# Altium schematic sheet MAIN.SchDoc
size 420 x 297 mm; SheetNumber: 1; SheetTotal: 1
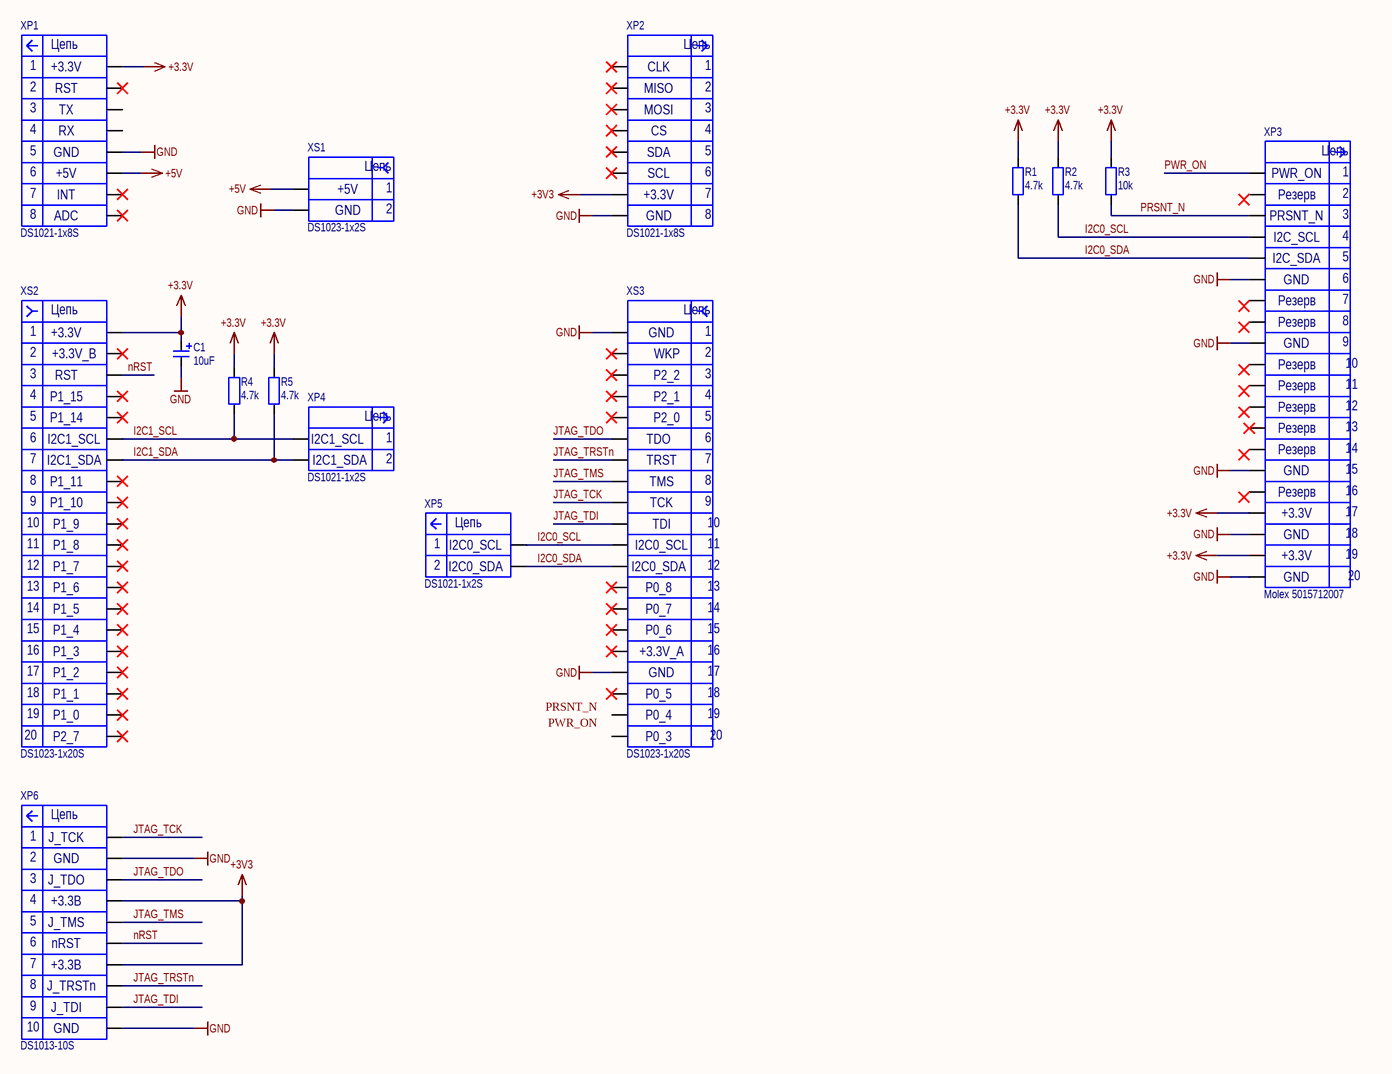
[diagram p0: MAIN.SchDoc]

## Parts
C1  10uF  [CAP ALSMD ELEC 4.3MM H5.4MM]
R1  4.7k  [RES 0603_1608]
R2  4.7k  [RES 0603_1608]
R3  10k  [RES 0603_1608]
R4  4.7k  [RES 0603_1608]
R5  4.7k  [RES 0603_1608]
XP1  DS1021-1x8S  Net_8: ADC  Net_7: INT  Net_6: +5V  Net_5: GND  Net_4: RX  Net_3: TX  Net_2: RST  Net_1: +3.3V  [DS1021-1x8S]
XP2  DS1021-1x8S  Net_8: GND  Net_7: +3.3V  Net_6: SCL  Net_5: SDA  Net_4: CS  Net_3: MOSI  Net_2: MISO  Net_1: CLK  [DS1021-1x8S]
XP3  Molex 5015712007  Net_20: GND  Net_19: +3.3V  Net_16: Резерв  Net_5: I2C_SDA  Net_4: I2C_SCL  Net_3: PRSNT_N  Net_1: PWR_ON  [Molex 5015712007]
XP4  DS1021-1x2S  Net_2: I2C1_SDA  Net_1: I2C1_SCL  [DS1021-1x2S]
XP5  DS1021-1x2S  Net_2: I2C0_SDA  Net_1: I2C0_SCL  [DS1021-1x2S]
XP6  DS1013-10S  Net_10: GND  Net_9: J_TDI  Net_8: J_TRSTn  Net_7: +3.3В  Net_6: nRST  Net_5: J_TMS  Net_3: J_TDO  Net_1: J_TCK  [DS1013-10S]
XS1  DS1023-1x2S  Net_2: GND  Net_1: +5V  [DS1023-1x2S]
XS2  DS1023-1x20S  Net_20: P2_7  Net_19: P1_0  Net_18: P1_1  Net_17: P1_2  Net_16: P1_3  Net_15: P1_4  Net_14: P1_5  Net_13: P1_6  Net_12: P1_7  Net_11: P1_8  Net_10: P1_9  Net_9: P1_10  Net_8: P1_11  Net_7: I2C1_SDA  Net_6: I2C1_SCL  Net_5: P1_14  Net_4: P1_15  Net_3: RST  Net_2: +3.3V_B  Net_1: +3.3V  [DS1023-1x20S]
XS3  DS1023-1x20S  Net_20: P0_3  Net_19: P0_4  Net_18: P0_5  Net_17: GND  Net_16: +3.3V_A  Net_15: P0_6  Net_14: P0_7  Net_13: P0_8  Net_12: I2C0_SDA  Net_11: I2C0_SCL  Net_10: TDI  Net_9: TCK  Net_8: TMS  Net_7: TRST  Net_6: TDO  Net_5: P2_0  Net_4: P2_1  Net_3: P2_2  Net_2: WKP  [DS1023-1x20S]

## Nets
+3.3V: C1.1(P) R1.2 R2.2 R3.2 R4.2 R5.2 XP1.1 XP3.17 XP3.19 XS2.1
+3V3: XP2.7 XP6.4 XP6.7
+5V: XP1.6 XS1.1
GND: C1.2(N) XP1.5 XP2.8 XP3.6 XP3.9 XP3.15 XP3.18 XP3.20 XP6.2 XP6.10 XS1.2 XS3.1 XS3.17
I2C0_SCL: R2.1 XP3.4 XP5.1 XS3.11
I2C0_SDA: R1.1 XP3.5 XP5.2 XS3.12
I2C1_SCL: R4.1 XP4.1 XS2.6
I2C1_SDA: R5.1 XP4.2 XS2.7
JTAG_TCK: XP6.1 XS3.9
JTAG_TDI: XP6.9 XS3.10
JTAG_TDO: XP6.3 XS3.6
JTAG_TMS: XP6.5 XS3.8
JTAG_TRSTn: XP6.8 XS3.7
nRST: XP6.6 XS2.3
PRSNT_N: R3.1 XP3.3
PWR_ON: XP3.1

Not connected (* = marked no-connect by the designer): XP1 2* 3 4 7* 8*; XP2 1* 2* 3* 4* 5* 6*; XP3 2 7 8 10 11 12 13* 14 16; XS2 2* 4* 5* 8* 9* 10* 11* 12* 13* 14* 15* 16* 17* 18* 19* 20*; XS3 2* 3* 4* 5* 13* 14* 15* 16* 18* 19 20

## Notes on the sheet
- Labels drawn without touching a wire or pin: PRSNT_N, PWR_ON
- Перв. примен.
- Справ. №
- Подп. и дата
- Инв. № дубл.
- Взам. инв. №
- Разраб.
- Изм.
- Лист
- № докум.
- Подп.
- Дата
- Лит.
- Масса
- Масштаб
- Пров.
- Т.контр.
- Листов
- Инв. № подл.
- Утв.
- Н.контр.
- Копировал
- Формат А3
- (in symbol DS1013-10S) Цепь
- (in symbol DS1021-1x2S) Цепь
- (in symbol DS1021-1x8S) Цепь
- (in symbol DS1023-1x2S) Цепь
- (in symbol DS1023-1x20S) Цепь
- (in symbol Molex 5015712007) Цепь

## Library data of the parts
C1 = К50-97 – 25В – 10мкФ (±20) % – ЕВАЯ.673541.054ТУ: Конденсатор К50-97 – 25В – 10мкФ (±20) % – ЕВАЯ.673541.054ТУ; Manufacturer: АО Элеконд; Group: Конденсаторы полярные; Type: Конденсатор электролитический; Tolerance: ± 20%; Dielectric type: Electrolytic; Voltage: 25V; Manufacturer Part Number: К50-97 – 25В – 10мкФ (±20) % – ЕВАЯ.673541.054ТУ; Name: К50-97 – 25В – 10мкФ (±20) % – ЕВАЯ.673541.054ТУ; Value: 10uF; Country: Россия; Package: SMD D4x5.4; HelpURL: https://elecond.ru/pdf/k50-97.pdf
R1 R2 R4 R5 = RC0603FR-074K7L: Резистор 0603-0,1Вт-4.7кОм ± 1%; Manufacturer: Yageo; Group: Резисторы; Power: 0.1W; Voltage: 75V; Manufacturer Part Number: RC0603FR-074K7L; Type: Резистор; Name: RC0603FR-074K7L; Value: 4.7k; Tolerance: ± 1%; Country: Тайвань; Package: SMD0603; HelpURL: https://static.chipdip.ru/lib/175/DOC011175144.pdf
R3 = RC0603FR-0710KL: Резистор 0603-0,1Вт-10кОм ± 1%; Manufacturer: Yageo; Group: Резисторы; Power: 0.1W; Voltage: 75V; Manufacturer Part Number: RC0603FR-0710KL; Type: Резистор; Name: RC0603FR-0710KL; Value: 10k; Tolerance: ± 1%; Country: Тайвань; Package: SMD0603; HelpURL: https://static.chipdip.ru/lib/175/DOC011175144.pdf
XP1 XP2 = DS1021-1x8S: Соединитель DS1021-1x8S; Manufacturer: Connfly; Group: Соединители; Pins number: 8; Rows: 1; Nominal current: 3A; Nominal Voltage: 250V; Max Temperature: 105°С; Min Temperature: -40°С; Manufacturer Part Number: DS1021-1x8S; Type: Штыри прямые; Name: DS1021-1x8S; Country: Китай
XP3 = Molex 5015712007: Соединитель Molex 5015712007; Group: Соединители; Pins number: 20; Rows: 2; Nominal current: 1A; Nominal Voltage: 50V; Max Temperature: 105°С; Min Temperature: -40°С; Net_18: GND; Net_17: +3.3V; Net_15: GND; Net_14: Резерв; Net_13: Резерв; Net_12: Резерв; Net_11: Резерв; Net_10: Резерв; Net_9: GND; Net_8: Резерв; Net_7: Резерв; Net_6: GND; Net_2: Резерв; Manufacturer Part Number: Molex 5015712007; Type: Вилка угловая; Name: Molex 5015712007; Country: США; Manufacturer: Molex
XP4 XP5 = DS1021-1x2S: Соединитель DS1021-1x2S; Manufacturer: Connfly; Group: Соединители; Pins number: 2; Rows: 1; Nominal current: 3A; Nominal Voltage: 250V; Max Temperature: 105°С; Min Temperature: -40°С; Manufacturer Part Number: DS1021-1x2S; Type: Штыри прямые; Name: DS1021-1x2S; Country: Китай
XP6 = DS1013-10S: Соединитель DS1013-10S; Manufacturer: Connfly; Group: Соединители; Pins number: 10; Rows: 2; Nominal current: 1A; Nominal Voltage: 500V; Max Temperature: 105°С; Min Temperature: -40°С; Manufacturer Part Number: DS1013-10S; Type: Вилка прямая; Net_4: +3.3В; Net_2: GND; Name: DS1013-10S; Country: Китай
XS1 = DS1023-1x2S: Соединитель DS1023-1x2S; Manufacturer: Connfly; Group: Соединители; Pins number: 2; Rows: 1; Nominal current: 1A; Nominal Voltage: 250V; Max Temperature: 105°С; Min Temperature: -40°С; Manufacturer Part Number: DS1023-1x2S; Type: Гнездо на плату; Name: DS1023-1x2S; Country: Китай
XS2 XS3 = DS1023-1x20S: Соединитель DS1023-1x20S; Manufacturer: Connfly; Group: Соединители; Pins number: 20; Rows: 1; Nominal current: 1A; Nominal Voltage: 250V; Max Temperature: 105°С; Min Temperature: -40°С; Manufacturer Part Number: DS1023-1x20S; Type: Гнездо на плату; Name: DS1023-1x20S; Country: Китай
  XS3: Net_1: GND